# Altium schematic sheet Conectores.SchDoc: Conectores
size A4; DrawnBy: João Bortolace; Revision: 1.0; SheetNumber: 6; SheetTotal: 6
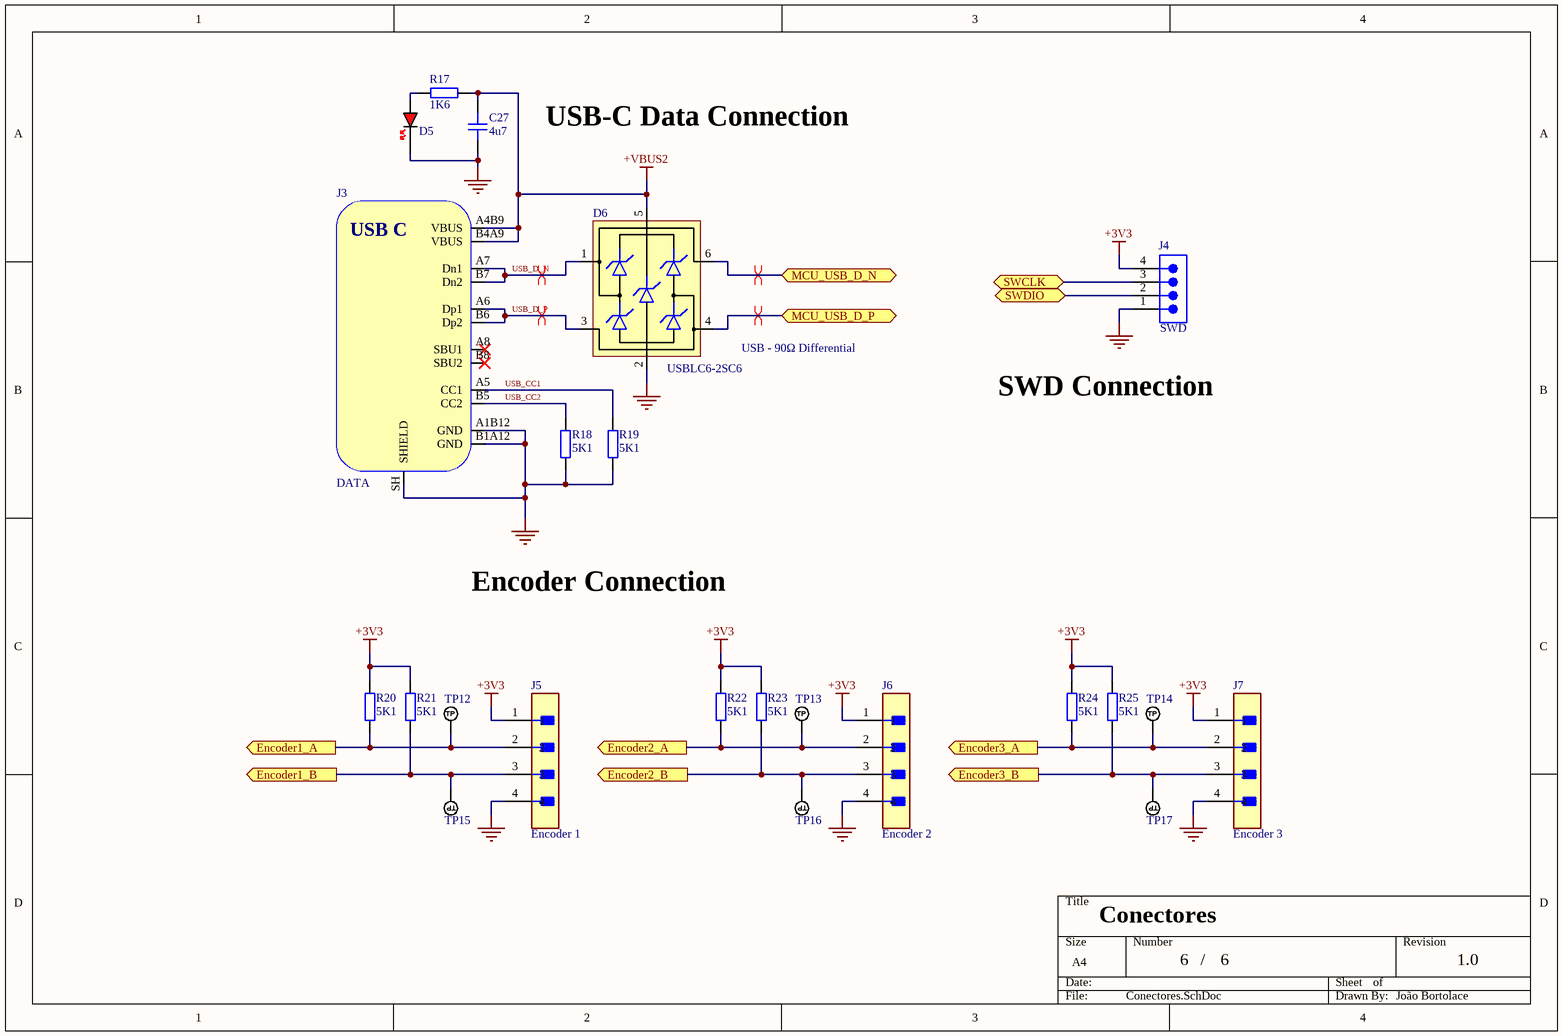
[diagram p0: Conectores.SchDoc]

## Parts
C27  4u7  [CAP_0805]
D5  USB  [LED_0402_RED]  (value not drawn)
D6  USBLC6-2SC6  [SOT-23-6]
J3  DATA  [USB4105-GF-A-060]
J4  SWD  [SMTC-PHT-104-01-X-S]  (no BOM)
J5  Encoder 1  [FP-470531000-MFG]  (no BOM)
J6  Encoder 2  [FP-470531000-MFG]  (no BOM)
J7  Encoder 3  [FP-470531000-MFG]  (no BOM)
R17  1K6  [RES_0402]
R18  5K1  [RES_0603]
R19  5K1  [RES_0603]
R20  5K1  [RES_0402]
R21  5K1  [RES_0402]
R22  5K1  [RES_0402]
R23  5K1  [RES_0402]
R24  5K1  [RES_0402]
R25  5K1  [RES_0402]
TP12  TP_NOBOM  [PAD_RND_1MM]  (value not drawn)  (no BOM)
TP13  TP_NOBOM  [PAD_RND_1MM]  (value not drawn)  (no BOM)
TP14  TP_NOBOM  [PAD_RND_1MM]  (value not drawn)  (no BOM)
TP15  TP_NOBOM  [PAD_RND_1MM]  (value not drawn)  (no BOM)
TP16  TP_NOBOM  [PAD_RND_1MM]  (value not drawn)  (no BOM)
TP17  TP_NOBOM  [PAD_RND_1MM]  (value not drawn)  (no BOM)

## Ports
Encoder1_A (out, see Esquemático Principal[2C], Microcontrolador[1D]), Encoder1_B (out, see Esquemático Principal[2C], Microcontrolador[1C]), Encoder2_A (out, see Esquemático Principal[2C], Microcontrolador[3B]), Encoder2_B (out, see Esquemático Principal[2C], Microcontrolador[3B]), Encoder3_A (out, see Esquemático Principal[2C], Microcontrolador[3B]), Encoder3_B (out, see Esquemático Principal[2C], Microcontrolador[3B]), MCU_USB_D_N (bidir, see Esquemático Principal[2C], Microcontrolador[1B]), MCU_USB_D_P (bidir, see Esquemático Principal[2C], Microcontrolador[1B]), SWCLK (bidir, see Esquemático Principal[2C], Microcontrolador[1B]), SWDIO (bidir, see Esquemático Principal[2C], Microcontrolador[1B])

## Nets
+3V3: J4.4 J5.1 J6.1 J7.1 R20.2 R21.2 R22.2 R23.2 R24.2 R25.2
+VBUS2: C27.2 D6.5(VBUS) J3.A4B9(VBUS) J3.B4A9(VBUS) R17.2
GND: C27.1 D5.K D6.2(GND) J3.A1B12(GND) J3.B1A12(GND) J3.SH(SHIELD) J4.1 J5.4 J6.4 J7.4 R18.1 R19.1
Encoder1_A: J5.2 R20.1 TP12.1(TP) ; port Encoder1_A
Encoder1_B: J5.3 R21.1 TP15.1(TP) ; port Encoder1_B
Encoder2_A: J6.2 R22.1 TP13.1(TP) ; port Encoder2_A
Encoder2_B: J6.3 R23.1 TP16.1(TP) ; port Encoder2_B
Encoder3_A: J7.2 R24.1 TP14.1(TP) ; port Encoder3_A
Encoder3_B: J7.3 R25.1 TP17.1(TP) ; port Encoder3_B
MCU_USB_D_N: D6.6(IO1) ; port MCU_USB_D_N
MCU_USB_D_P: D6.4(IO2) ; port MCU_USB_D_P
SWCLK: J4.3 ; port SWCLK
SWDIO: J4.2 ; port SWDIO
USB_CC1: J3.A5(CC1) R19.2
USB_CC2: J3.B5(CC2) R18.2
USB_D_N: D6.1(IO1) J3.A7(Dn1) J3.B7(Dn2)
USB_D_P: D6.3(IO2) J3.A6(Dp1) J3.B6(Dp2)
NetD5_A: D5.A R17.1

Not connected (* = marked no-connect by the designer): J3 A8(SBU1)* B8(SBU2)*

## Layout directives
differential pair: USB_D_N, USB_D_P
differential pair; net class USB_DIFF: MCU_USB_D_N, MCU_USB_D_P

## Notes on the sheet
- USB-C Data Connection
- (near D6) USB - 90Ω Differential
- SWD Connection
- Encoder Connection
- /
- (in symbol USB4105-GF-A-060) USB C

## Library data of the parts
C27 = CAP_0805: 4.7uF ±10% 50V Ceramic Capacitor X5R 0805; Manufacturer: Samsung Electro-Mechanics; Manufacturer Part Number: CL21A475KBQNNNE; Distributor Link: https://www.lcsc.com/product-detail/C98192.html?s_z=n_capacitor%25204.7u; LCSC: C98192; Rating: *; Dielectric: *
D5 = LED_0402_RED: LED 0402 RED SMD
D6 = USBLC6-2SC6: Low-Capacitance ESD Protection USB; Manufacturer: STMicroelectronics; Manufacturer Part Number: USBLC6-2SC6; Distributor Link: https://www.mouser.de/ProductDetail/STMicroelectronics/USBLC6-2SC6?qs=po45yt2pPpu%2FhNIlwQdTlg%3D%3D; LCSC: C7519
J3 = USB4105-GF-A-060: USB-C (USB TYPE-C) Receptacle Connector 16 Position Surface Mount, Right Angle; Manufacturer: DEALON; Manufacturer Part Number: USB-TYPE-C-018; Part Link: https://www.lcsc.com/product-detail/C2927038.html?s_z=n_usb%2520type%2520c; LCSC: C2927038
J4 = CMP-1024-00182-1: Press Fit Header, Through-hole, Vertical, -55 to 125 degC, 2.54 mm Pitch, 4-Pin, Male, RoHS; Manufacturer: Samtec; PartNumber: PHT-104-01-L-S; Pitch: 2.54 mm; PackageDescription: .100 Press Fit Socket Assembly; ComponentLink2URL: http://www.samtec.com/documents/webfiles/pdf/pht.pdf; ComponentLink3Description: Package Specification; Temperature Range: -55 to 125 degC; ComponentLink1URL: http://www.samtec.com; Orientation: Vertical; ComponentLink1Description: Manufacturer URL; RoHS: True; DatasheetVersion: F-214; Mounting Technology: Through-hole; PackageReference: PHT-104-01-X-S; ComponentLink2Description: Datasheet; ComponentLink3URL: http://www.samtec.com/documents/webfiles/cpdf/PHT-1XX-XX-X-X-XXX-MKT.pdf; PackageVersion: J, 9/2009
J5-J7 = CMP-04776-000290-2: CONN HEADER VERT 4POS 2.54MM; NexarPartId: 854935; Manufacturer Lifecycle Status: ACTIVE; Voltage Rating (DC): 250V; Gender: Male; Plating: Copper; Number of Positions: 4; Glow Wire Compliant: Non-compliant; Current Rating: 500mA; Max Operating Temperature: 75°C; Number of Rows: 1; REACH SVHC: Unknown; Ambient Temperature Range High: 105°C; Pitch: 2.54mm; Height: 7.7mm; Min Operating Temperature: 0°C; Packaging: Bulk; Contact Material: Brass, Copper; Contact Plating: Tin; Lead Pitch: 2.54mm; Voltage Rating: 250V; Termination: Through Hole; Radiation Hardening: No; Orientation: Vertical; Mount: Through Hole; Number of Pins: 4; Country of Origin: HK; Halogen Free: Low Halogen; Lifecycle Status: Production; Number of Circuits: 4; Schedule B: 8536694040, 8536694040; Housing Color: Beige; Housing Material: Nylon; Depth: 5.84mm; RoHS: Compliant; Length: 10.2mm; Number of Contacts: 4
R17 R20-R25 = RES_0402: Resistor SMD 0402; Manufacturer: *; Manufacturer Part Number: *; Distributor Link: *; LCSC: *
R18 R19 = RES_0603: Resistor SMD 0603; Manufacturer: *; Manufacturer Part Number: *; Distributor Link: *; LCSC: *
TP12-TP17 = TEST_POINT_RND_1MM: Test Point Round 1mm (NO BOM)